# Altium schematic sheet RTC.SchDoc
size B
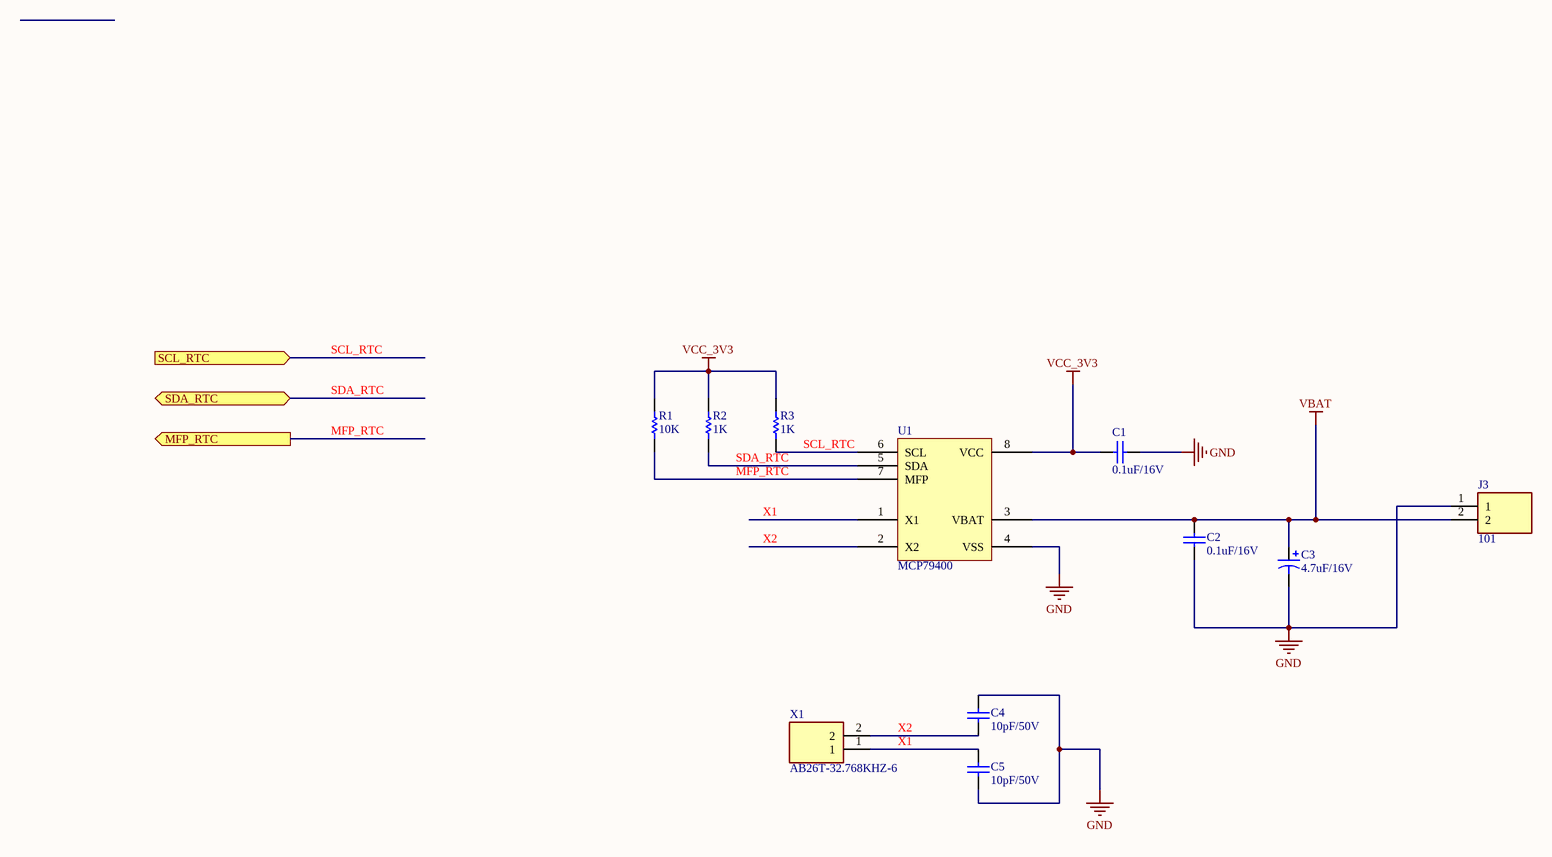
[diagram p0: RTC.SchDoc]

## Parts
C1  0.1uF/16V  [0603C]
C2  0.1uF/16V  [0603C]
C3  4.7uF/16V  [CASE-A]
C4  10pF/50V  [0603C]
C5  10pF/50V  [0603C]
J3  101  [101]
R1  10K  [0603R]
R2  1K  [0603R]
R3  1K  [0603R]
U1  MCP79400  [MCP79400-I/SN]
X1  AB26T-32.768KHZ-6  [AB26T32768KHZE]

## Ports
MFP_RTC (out), SCL_RTC (in), SDA_RTC (bidir)

## Nets
GND: C1.2 C2.2 C3.2 C4.1 C5.2 J3.1 U1.4(VSS)
VBAT: C2.1 C3.1 J3.2 U1.3(VBAT)
VCC_3V3: C1.1 R1.2 R2.2 R3.2 U1.8(VCC)
MFP_RTC: R1.1 U1.7(MFP) ; port MFP_RTC
SCL_RTC: R3.1 U1.6(SCL) ; port SCL_RTC
SDA_RTC: R2.1 U1.5(SDA) ; port SDA_RTC
X1: C5.1 U1.1(X1) X1.1
X2: C4.2 U1.2(X2) X1.2

## Library data of the parts
C1 = Cap: Multilayer Ceramic Capacitors MLCC - SMD/SMT 0603 16VDC 0.1uF 10% X7R AEC-Q2000; Mfr: Taiyo Yuden; Mfr Part No: EMK107B7104KAHT; Value: 0.1uF/16V; Package: 0603; Price: 0.101; Stockiest: MOUSER; Stockiest Part No: 963-EMK107B7104KAHT
C2 = 0805_CAP: Multilayer Ceramic Capacitors MLCC - SMD/SMT 0603 16VDC 0.1uF 10% X7R AEC-Q2000; Mfr Part No: EMK107B7104KAHT; Mfr: Taiyo Yuden; Price: 0.101; Stockiest: MOUSER; Stockiest Part No: 963-EMK107B7104KAHT; Value: 0.1uF/16V; Package: 0603
C3 = Cap Pol1: Tantalum Capacitors - Solid SMD 16V 4.7uF 1206; Mfr: KEMET; Mfr Part No: T495A475K016ATA2K0; Value: 4.7uF/16V; Package: 1206; Price: 1.83; Stockiest: MOUSER; Stockiest Part No: 80-T495A475K16ATA2K0
C4 C5 = Cap: Multilayer Ceramic Capacitors MLCC - SMD/SMT 50V 10pF 0603 C0G 5% AEC-Q200; Mfr: KEMET; Mfr Part No: C0603C100J5GACAUTO; Package: 0603; Price: 0.192; Stockiest: MOUSER; Stockiest Part No: 80-C0603C100J5GAUTO; Value: 10pF/50V
J3 = 101: Coin Cell Battery Holders 20mm coin cell HOLDER; Mfr Part No: 101; Price: 2.23; Stockiest: MOUSER; Stockiest Part No: 534-101; Value: -
R1 = Res1: Thick Film Resistors - SMD 0603 10Kohms 1% Anti-Sulfur AEC-Q200; Mfr: ROHM Semiconductor; Mfr Part No: SFR03EZPF1002; Value: 10K; Package: 0603; Price: 0.101; Stockiest: MOUSER; Stockiest Part No: 755-SFR03EZPF1002
R2 R3 = Res1: Resistor; Mfr: Vishay / Dale; Mfr Part No: CRCW06031K00FKEAC; Package: 0603; Price: 0.1; Stockiest: MOUSER; Stockiest Part No: 71-CRCW06031K00FKEAC; Value: 1K
U1 = MCP79400: Real Time Clock I2C GP RTCC 64B SRAM ID; Mfr: Microchip Technology; Mfr Part No: MCP79400-I/SN; Price: 0.827; Stockiest: MOUSER; Stockiest Part No: 579-MCP79400ISN
X1 = AB26T-32.768KHZ-6: Crystals 32.768KHz 6pF 32.768KHZ; Mfr: ABRACON; Mfr Part No: AB26T-32.768KHZ-6; Price: 0.252; Stockiest: MOUSER; Stockiest Part No: 815-AB26T-32.768K-6; Value: 32.768KHZ